# Altium project CC13XXEM-7XD-7793.PrjPcb
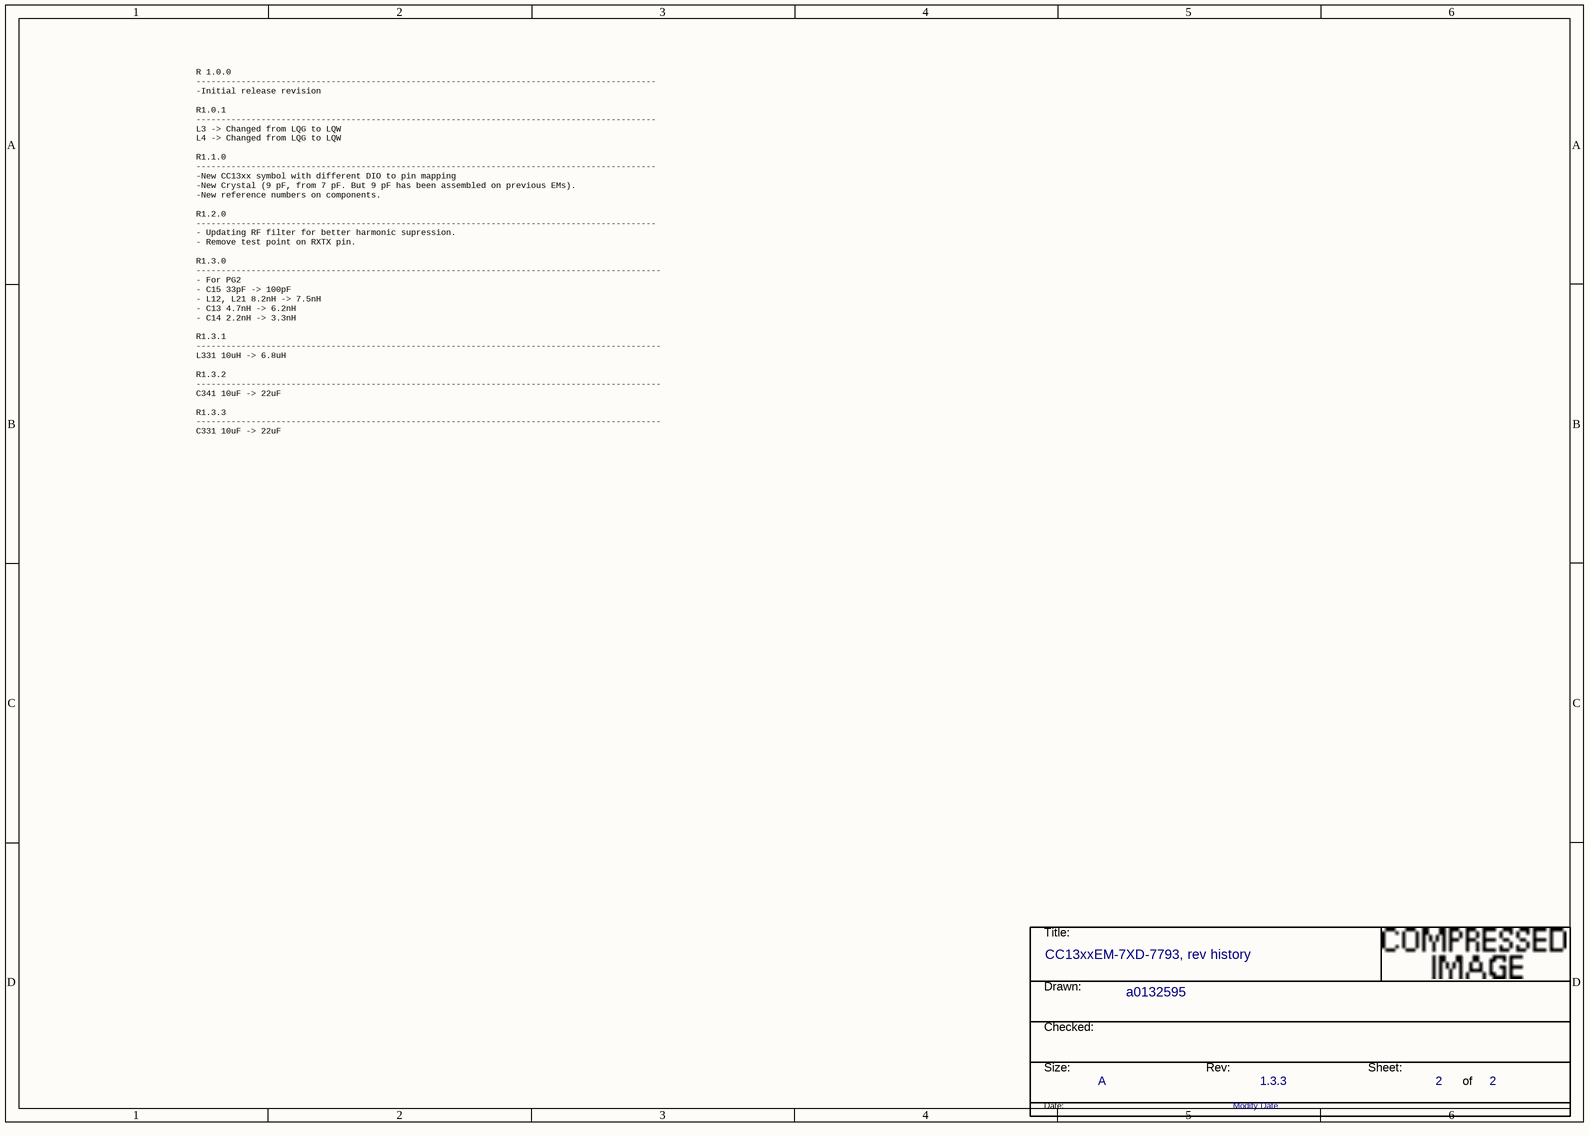
[diagram p0: Revision.SchDoc]
2 sheets, 51 parts. Net scope: global (net labels, ports and power ports of the same name join across sheets).
Sheets:
  Revision.SchDoc
  CC13xxEM-7XD-7793.SchDoc

## Sheet Revision.SchDoc
size 297 x 209 mm

### Parts
(Parts that share a designator on the sheet are numbered #1, #2 ... from top to bottom, then left to right.)
*#1  Title: CC13xxEM-7XD-7793, rev history  Page Number: 2  RevCode: 1.3.3  Page Size: A  Design Modify Date: Modify Date  Designer name: a0132595  (hidden comment: TI_Norway_Title_Block)  (graphical)

### Notes on the sheet
- R 1.0.0
  --------------------------------------------------------------------------------------------
  -Initial release revision
  R1.0.1
  --------------------------------------------------------------------------------------------
  L3 -> Changed from LQG to LQW
  L4 -> Changed from LQG to LQW
  R1.1.0
  --------------------------------------------------------------------------------------------
  -New CC13xx symbol with different DIO to pin mapping
  -New Crystal (9 pF, from 7 pF. But 9 pF has been assembled on previous EMs).
  -New reference numbers on components.
  R1.2.0
  --------------------------------------------------------------------------------------------
  - Updating RF filter for better harmonic supression.
  - Remove test point on RXTX pin.
  R1.3.0
  ---------------------------------------------------------------------------------------------
  - For PG2
  - C15 33pF -> 100pF
  - L12, L21 8.2nH -> 7.5nH
  - C13 4.7nH -> 6.2nH
  - C14 2.2nH -> 3.3nH
  R1.3.1
  ---------------------------------------------------------------------------------------------
  L331 10uH -> 6.8uH
  R1.3.2
  ---------------------------------------------------------------------------------------------
  C341 10uF -> 22uF
  R1.3.3
  ---------------------------------------------------------------------------------------------
  C331 10uF -> 22uF
- (in symbol TI_Norway_Title_Block) Title:; Drawn:; Checked:; Size:; Rev:; Sheet:; of; Date:

### Library data of the parts
*#1 = TI_Norway_Title_Block: Page Count: 2

## Sheet CC13xxEM-7XD-7793.SchDoc
size 420 x 297 mm
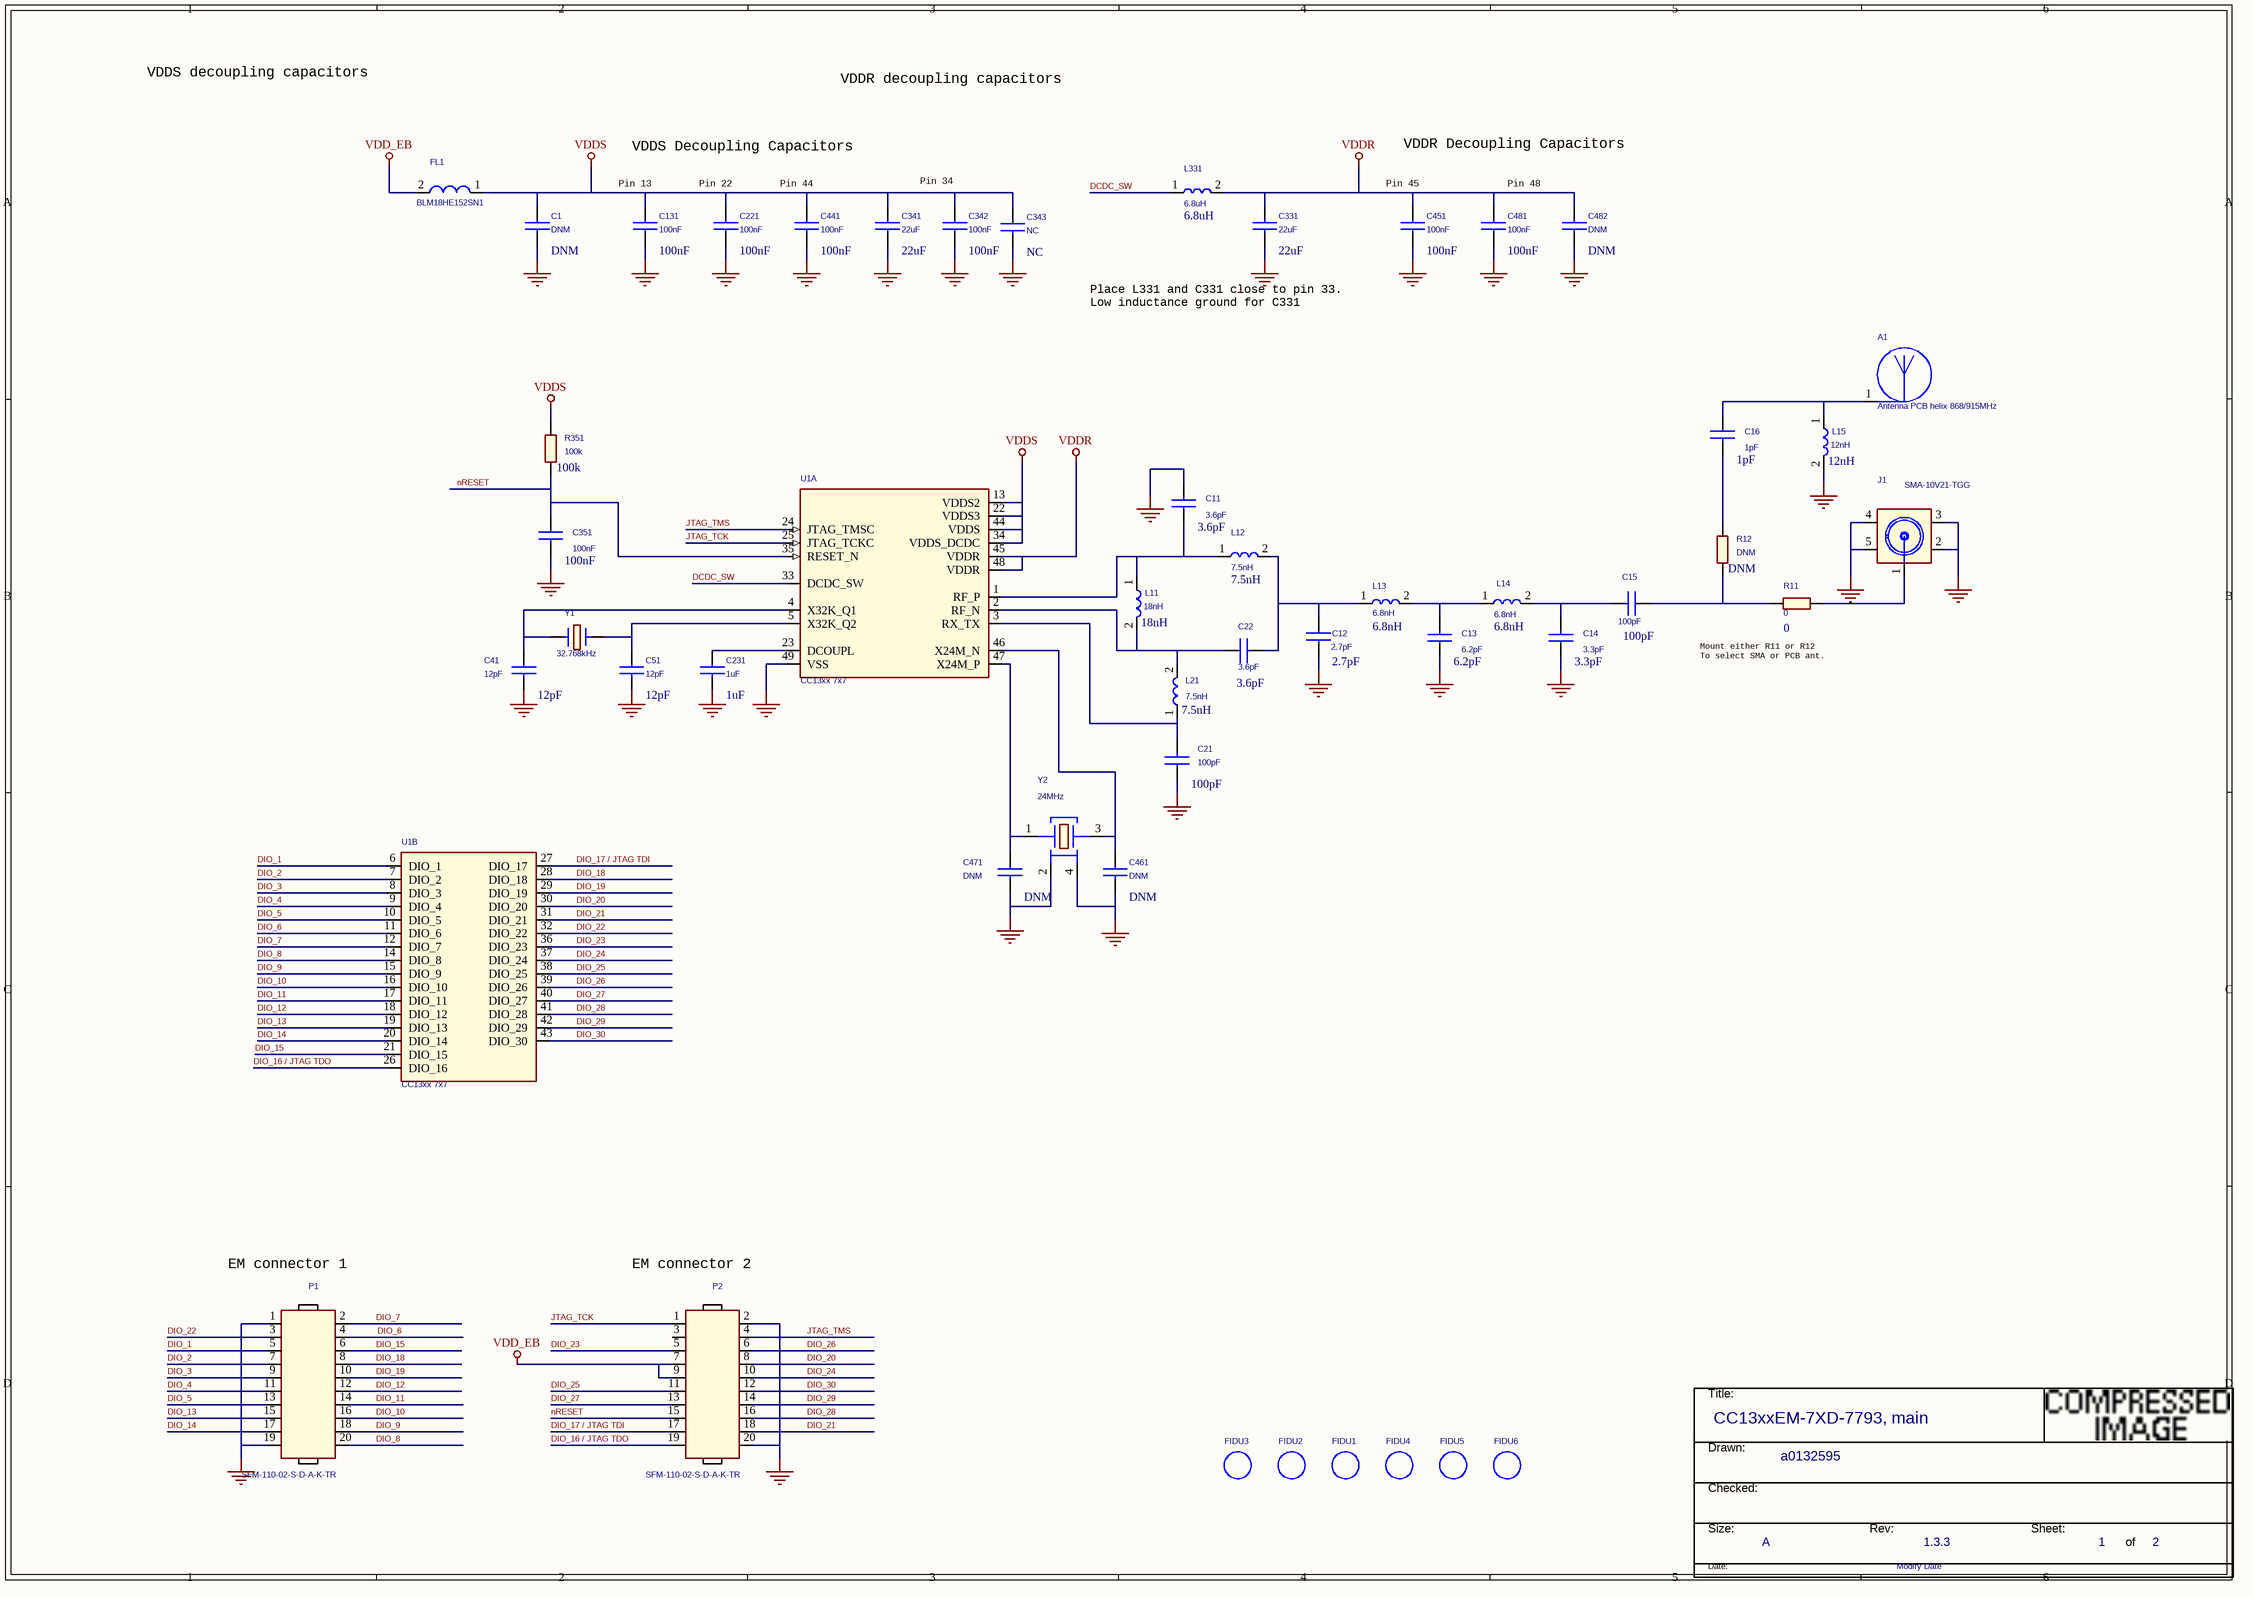
[diagram p1: CC13xxEM-7XD-7793.SchDoc]

### Parts
(Parts that share a designator on the sheet are numbered #1, #2 ... from top to bottom, then left to right.)
*#2  Title: CC13xxEM-7XD-7793, main  Page Number: 1  Page Count: 2  RevCode: 1.3.3  Page Size: A  Design Modify Date: Modify Date  Designer name: a0132595  (hidden comment: TI_Norway_Title_Block)  (graphical)
A1  Antenna PCB helix 868/915MHz  [Antenna868_915MHz]
C1  DNM  [CAPC1608X90L]
C11  3.6pF  [CAPC1005X60L]
C12  2.7pF  [CAPC1005X60L]
C13  6.2pF  [CAPC1005X60L]
C14  3.3pF  [CAPC1005X60L]
C15  100pF  [CAPC1005X60L]
C16  1pF  [CAPC1005X60L]
C21  100pF  [CAPC1005X60L]
C22  3.6pF  [CAPC1005X60L]
C41  12pF  [CAPC1005X60L]
C51  12pF  [CAPC1005X60L]
C131  100nF  [CAPC1005X60L]
C221  100nF  [CAPC1005X60L]
C231  1uF  [CAPC1005X60L]
C331  22uF  [CAPC1608X100A2L]
C341  22uF  [CAPC1608X100A2L]
C342  100nF  [CAPC1608X90L]
C343  NC  [CAPC1608X90L]
C351  100nF  [CAPC1005X60L]
C441  100nF  [CAPC1005X60L]
C451  100nF  [CAPC1005X60L]
C461  DNM  [CAPC1005X60L]
C471  DNM  [CAPC1005X60L]
C481  100nF  [CAPC1005X60L]
C482  DNM  [CAPC1005X60L]
FIDU1  FIDU_1MM  [FIDMARK]  (value not drawn)
FIDU2  FIDU_1MM  [FIDMARK]  (value not drawn)
FIDU3  FIDU_1MM  [FIDMARK]  (value not drawn)
FIDU4  FIDU_1MM  [FIDMARK]  (value not drawn)
FIDU5  FIDU_1MM  [FIDMARK]  (value not drawn)
FIDU6  FIDU_1MM  [FIDMARK]  (value not drawn)
FL1  BLM18HE152SN1  [FIL_BLM18HE152SN1DL]
J1  SMA-10V21-TGG  [HUSTSAN_SMA10V21TGGAN]
L11  18nH  [IND_LQW15AL]
L12  7.5nH  [IND_LQW15AN]
L13  6.8nH  [IND_LQW15AL]
L14  6.8nH  [IND_LQW15AL]
L15  12nH  [IND_LQW15AL]
L21  7.5nH  [IND_LQW15AN]
L331  6.8uH  [INDC2012X150L]
P1  SFM-110-02-S-D-A-K-TR  [SAMTEC_SFM11002AN]
P2  SFM-110-02-S-D-A-K-TR  [SAMTEC_SFM11002AN]
R11  0  [RESC1005X40L]
R12  DNM  [RESC1005X40L]
R351  100k  [RESC1005X40L]
U1  CC13xx 7x7  [QFNFC50P700X700X80-49CN]  (parts A,B of 2)
Y1  32.768kHz  [XTAL_FC-135N]
Y2  24MHz  [OSCCC250X320X60-4L]

### Nets
GND: C1.2 C11.2 C12.2 C13.1 C14.1 C21.1 C41.2 C51.2 C131.2 C221.2 C231.2 C331.2 C341.2 C342.2 C343.2 C351.2 C441.2 C451.2 C461.2 C471.2 C481.2 C482.2 J1.2 J1.3 J1.4 J1.5 L15.2 P1.1 P1.19 P2.2 P2.20 U1.49(VSS) Y2.2 Y2.4
VDD_EB: FL1.2 P2.7 P2.9
VDDR: C331.1 C451.1 C481.1 C482.1 L331.2 U1.45(VDDR) U1.48(VDDR)
VDDS: C1.1 C131.1 C221.1 C341.1 C342.1 C343.1 C441.1 FL1.1 R351.2 U1.13(VDDS2) U1.22(VDDS3) U1.34(VDDS_DCDC) U1.44(VDDS)
DCDC_SW: L331.1 U1.33(DCDC_SW)
DIO_1: P1.5 U1.6(DIO_1)
DIO_2: P1.7 U1.7(DIO_2)
DIO_3: P1.9 U1.8(DIO_3)
DIO_4: P1.11 U1.9(DIO_4)
DIO_5: P1.13 U1.10(DIO_5)
DIO_6: P1.4 U1.11(DIO_6)
DIO_7: P1.2 U1.12(DIO_7)
DIO_8: P1.20 U1.14(DIO_8)
DIO_9: P1.18 U1.15(DIO_9)
DIO_10: P1.16 U1.16(DIO_10)
DIO_11: P1.14 U1.17(DIO_11)
DIO_12: P1.12 U1.18(DIO_12)
DIO_13: P1.15 U1.19(DIO_13)
DIO_14: P1.17 U1.20(DIO_14)
DIO_15: P1.6 U1.21(DIO_15)
DIO_16 / JTAG TDO: P2.19 U1.26(DIO_16)
DIO_17 / JTAG TDI: P2.17 U1.27(DIO_17)
DIO_18: P1.8 U1.28(DIO_18)
DIO_19: P1.10 U1.29(DIO_19)
DIO_20: P2.8 U1.30(DIO_20)
DIO_21: P2.18 U1.31(DIO_21)
DIO_22: P1.3 U1.32(DIO_22)
DIO_23: P2.5 U1.36(DIO_23)
DIO_24: P2.10 U1.37(DIO_24)
DIO_25: P2.11 U1.38(DIO_25)
DIO_26: P2.6 U1.39(DIO_26)
DIO_27: P2.13 U1.40(DIO_27)
DIO_28: P2.16 U1.41(DIO_28)
DIO_29: P2.14 U1.42(DIO_29)
DIO_30: P2.12 U1.43(DIO_30)
JTAG_TCK: P2.1 U1.25(JTAG_TCKC)
JTAG_TMS: P2.4 U1.24(JTAG_TMSC)
nRESET: C351.1 P2.15 R351.1 U1.35(RESET_N)
NetA1_1: A1.1(FEED/GND_1) C16.1 L15.1
NetC11_1: C11.1 L11.1 L12.1 U1.1(RF_P)
NetC12_1: C12.1 C22.2 L12.2 L13.1
NetC13_2: C13.2 L13.2 L14.1
NetC14_2: C14.2 C15.2 L14.2
NetC15_1: C15.1 R11.2 R12.1
NetC16_2: C16.2 R12.2
NetC21_2: C21.2 L21.1 U1.3(RX_TX)
NetC22_1: C22.1 L11.2 L21.2 U1.2(RF_N)
NetC41_1: C41.1 U1.4(X32K_Q1) Y1.1
NetC51_1: C51.1 U1.5(X32K_Q2) Y1.2
NetC231_1: C231.1 U1.23(DCOUPL)
NetC461_1: C461.1 U1.46(X24M_N) Y2.3
NetC471_1: C471.1 U1.47(X24M_P) Y2.1
NetJ1_1: J1.1 R11.1

Not connected (* = marked no-connect by the designer): FIDU1 1; FIDU2 1; FIDU3 1; FIDU4 1; FIDU5 1; FIDU6 1; P2 3

### Notes on the sheet
- VDDS decoupling capacitors
- VDDR decoupling capacitors
- (near C131) Pin 13
- VDDS Decoupling Capacitors
- (near C221) Pin 22
- (near C441) Pin 44
- Pin 34
- (near C451) Pin 45
- VDDR Decoupling Capacitors
- Pin 48
- Place L331 and C331 close to pin 33.
  Low inductance ground for C331
- (near R11) Mount either R11 or R12
  To select SMA or PCB ant.
- (near P1) EM connector 1
- (near P2) EM connector 2
- (in symbol TI_Norway_Title_Block) Title:; Drawn:; Checked:; Size:; Rev:; Sheet:; of; Date:

### Library data of the parts
A1 = ANTENNA: MECHANIC, ANTENNA PCB HELIX 868/915MHz, SMD; Part Number: 13-00397; Manufacturer: TEXAS INSTRUMENTS; MPN Status: ACTIVE; Designed by: Pawel Kwaskiewicz; FPLIST: Antenna868_915MHz,Antenna868_915MHz_MIRROR,; Old Footprint: Antenna868_915MHz,Antenna868_915MHz_MIRROR; NOTE Status: PREFERRED; Definied Quality: COMMERCIAL; Packing Size: 2500; Packing Type: TAPE_&_REEL; Design date: 2010-02-22; Revision: R002; Mounting Type: SMD; Part Type: MECHANIC\ANTENNA; Max Oper Temp: N/A; Min Oper Temp: N/A; Frequency: 868/915MHz; MPN: ANTENNA PCB HELIX 868/915MHz; RoHS Status: ROHS_COMPLIANT; Lead Time: N/A; Budget Price: N/A; Budget Currency: N/A; Last Time Buy: N/A; WEIGHT: N/A; Esd Level: N/A; MTBF: N/A; MTBF Standard: N/A; MSL: N/A; Datasheet URL 1: N/A; Datasheet URL 2: www.ti.com; AutoDoc File: http://notefied-dynamic-precision.com/DB/Apps/Desktop/Item/Object.aspx?id=87165
C1 = CAPACITOR: CAPACITOR, DO NOT MOUNT, 0603, SMD; Part Number: 02-01324; TC2: 0; MAX_TEMP: CTMAX; SLOPE: CSMAX; DIST: FLAT; PSpiceTemplate: C^@REFDES %1 %2 ?TOLERANCE|C^@REFDES| @VALUE ?IC/IC=@IC/ TC=@TC1,@TC2 ?TOLERANCE|\n.model C^@REFDES CAP C=1 DEV=@TOLERANCE%|; KNEE: CBMAX; CURRENT: CIMAX; VOLTAGE: CMAX; Old Footprint: CAPC1608X90N,0603; ALT_SYMBOLS: CAPC1608X90L,CAPC1608X90M; FPLIST: CAPC1608X90N,CAPC1608X90L,CAPC1608X90M; TC1: 0; Value: DNM; AutoDoc File: http://notefied-dynamic-precision.com/DB/Apps/Desktop/Item/Object.aspx?id=50475; Part Type: CAPACITOR\CERAMIC\0603; Revision: R003
C11 = CAPACITOR: CAPACITOR, CERAMIC C0G/NP0, 3.6pF, 50V, -0.25pF/+0.25pF, -55DEGC/+125DEGC, 0402, SMD; MPN Status: ACTIVE; MPN: GRM1555C1H3R6CA01D; Manufacturer: MURATA; Part Number: 02-06008; TC2: 0; MAX_TEMP: CTMAX; SLOPE: CSMAX; DIST: FLAT; PSpiceTemplate: C^@REFDES %1 %2 ?TOLERANCE|C^@REFDES| @VALUE ?IC/IC=@IC/ TC=@TC1,@TC2 ?TOLERANCE|\n.model C^@REFDES CAP C=1 DEV=@TOLERANCE%|; KNEE: CBMAX; CURRENT: CIMAX; VOLTAGE: CMAX; Packing Type: TAPE_&_REEL; Packing Size: 10000; NOTE Status: PREFERRED; PCB Package: 0402; Old Footprint: CAPC1005X60N; ALT_SYMBOLS: CAPC1005X60L,CAPC1005X60M; FPLIST: CAPC1005X60N,CAPC1005X60L,CAPC1005X60M; TC1: 0; Value: 3.6pF; AutoDoc File: http://notefied-dynamic-precision.com/DB/Apps/Desktop/Item/Object.aspx?id=95903; Datasheet URL 2: http://psearch.murata.com/capacitor/product/GRM1555C1H3R6CA01%23.pdf; RoHS Status: ROHS_COMPLIANT; Dielectric Type: C0G/NP0; Capacitance: 3.6pF; Rtd Voltage: 50V; Min Tol: -0.25pF; Max Tol: +0.25pF; Min Oper Temp: -55DEGC; Max Oper Temp: +125DEGC; Part Type: CAPACITOR\CERAMIC\0402; Mounting Type: SMD; Revision: R001
C12 = CAPACITOR: CAPACITOR, CERAMIC C0G/NP0, 2.7pF, 50V, -0.25pF/+0.25pF, -55DEGC/+125DEGC, 0402, SMD; MPN Status: ACTIVE; MPN: GRM1555C1H2R7CA01D; Manufacturer: MURATA; Part Number: 02-04679; TC2: 0; MAX_TEMP: CTMAX; SLOPE: CSMAX; DIST: FLAT; PSpiceTemplate: C^@REFDES %1 %2 ?TOLERANCE|C^@REFDES| @VALUE ?IC/IC=@IC/ TC=@TC1,@TC2 ?TOLERANCE|\n.model C^@REFDES CAP C=1 DEV=@TOLERANCE%|; KNEE: CBMAX; CURRENT: CIMAX; VOLTAGE: CMAX; Packing Type: TAPE_&_REEL; Packing Size: 10000; Budget Currency: EUR; Budget Price: 0.006; NOTE Status: PREFERRED; PCB Package: 0402; Old Footprint: CAPC1005X60N; ALT_SYMBOLS: CAPC1005X60L,CAPC1005X60M; FPLIST: CAPC1005X60N,CAPC1005X60L,CAPC1005X60M; Lead Time: 12; Definied Quality: INDUSTRIAL; TC1: 0; Value: 2.7pF; AutoDoc File: http://notefied-dynamic-precision.com/DB/Apps/Desktop/Item/Object.aspx?id=87809; RoHS Status: ROHS_COMPLIANT; Min Oper Temp: -55DEGC; Max Oper Temp: +125DEGC; Part Type: CAPACITOR\CERAMIC\0402; Mounting Type: SMD; Revision: R001; Max Tol: +0.25pF; Min Tol: -0.25pF; Rtd Voltage: 50V; Capacitance: 2.7pF; Dielectric Type: C0G/NP0; Last Time Buy: N/A; WEIGHT: 0.0016g; Esd Level: N/A; MTBF: N/A; MTBF Standard: N/A; MSL: 1; Datasheet URL 1: http://search.murata.co.jp/Ceramy/image/img/w_hinm/L0005E.pdf; Datasheet URL 2: http://psearch.murata.com/capacitor/product/GRM1555C1H2R7CA01%23.pdf
C13 = CAPACITOR: CAPACITOR, CERAMIC C0G/NP0, 6.2pF, 50V, -0.25pF/+0.25pF, -55DEGC/+125DEGC, 0402, SMD; MPN Status: ACTIVE; MPN: GRM1555C1H6R2CA01D; Manufacturer: MURATA; Part Number: 02-04608; TC2: 0; MAX_TEMP: CTMAX; SLOPE: CSMAX; DIST: FLAT; PSpiceTemplate: C^@REFDES %1 %2 ?TOLERANCE|C^@REFDES| @VALUE ?IC/IC=@IC/ TC=@TC1,@TC2 ?TOLERANCE|\n.model C^@REFDES CAP C=1 DEV=@TOLERANCE%|; KNEE: CBMAX; CURRENT: CIMAX; VOLTAGE: CMAX; Definied Quality: INDUSTRIAL; Budget Currency: EUR; Budget Price: 0.006; Lead Time: 10; Packing Type: TAPE_&_REEL; Packing Size: 10000; NOTE Status: PREFERRED; PCB Package: 0402; Old Footprint: CAPC1005X60N; ALT_SYMBOLS: CAPC1005X60L,CAPC1005X60M; FPLIST: CAPC1005X60N,CAPC1005X60L,CAPC1005X60M; TC1: 0; Value: 6.2pF; MSL: 1; MTBF Standard: N/A; MTBF: N/A; Esd Level: N/A; Last Time Buy: N/A; Datasheet URL 1: http://search.murata.co.jp/Ceramy/image/img/w_hinm/L0005E.pdf; AutoDoc File: http://notefied-dynamic-precision.com/DB/Apps/Desktop/Item/Object.aspx?id=87255; Datasheet URL 2: http://psearch.murata.com/capacitor/product/GRM1555C1H6R2CA01%23.pdf; WEIGHT: 0.0016g; RoHS Status: ROHS_COMPLIANT; Dielectric Type: C0G/NP0; Capacitance: 6.2pF; Rtd Voltage: 50V; Min Tol: -0.25pF; Max Tol: +0.25pF; Min Oper Temp: -55DEGC; Max Oper Temp: +125DEGC; Part Type: CAPACITOR\CERAMIC\0402; Mounting Type: SMD; Revision: R001
C14 = CAPACITOR: CAPACITOR, CERAMIC C0G/NP0, 3.3pF, 50V, -0.25pF/+0.25pF, -55DEGC/+125DEGC, 0402, SMD; Part Number: 02-04369; Manufacturer: MURATA; MPN: GRM1555C1H3R3CA01D; MPN Status: ACTIVE; TC2: 0; MAX_TEMP: CTMAX; SLOPE: CSMAX; DIST: FLAT; PSpiceTemplate: C^@REFDES %1 %2 ?TOLERANCE|C^@REFDES| @VALUE ?IC/IC=@IC/ TC=@TC1,@TC2 ?TOLERANCE|\n.model C^@REFDES CAP C=1 DEV=@TOLERANCE%|; KNEE: CBMAX; CURRENT: CIMAX; VOLTAGE: CMAX; Min TC: -30PPM/DEGC; Max TC: +30PPM/DEGC; FPLIST: CAPC1005X60N,CAPC1005X60L,CAPC1005X60M; ALT_SYMBOLS: CAPC1005X60L,CAPC1005X60M; Old Footprint: CAPC1005X60N; PCB Package: 0402; NOTE Status: PREFERRED; Lead Time: 12; Budget Price: 0.006; Budget Currency: EUR; Packing Size: 10000; Packing Type: TAPE_&_REEL; Definied Quality: INDUSTRIAL; TC1: 0; Value: 3.3pF; Revision: R001; Mounting Type: SMD; Part Type: CAPACITOR\CERAMIC\0402; Max Oper Temp: +125DEGC; Min Oper Temp: -55DEGC; RoHS Status: ROHS_COMPLIANT; WEIGHT: 0.0016g; Datasheet URL 2: http://psearch.murata.com/capacitor/product/GRM1555C1H3R3CA01%23.pdf; AutoDoc File: http://notefied-dynamic-precision.com/DB/Apps/Desktop/Item/Object.aspx?id=86077; Last Time Buy: N/A; Esd Level: N/A; MTBF: N/A; MTBF Standard: N/A; MSL: 1; Datasheet URL 1: http://search.murata.co.jp/Ceramy/image/img/w_hinm/L0005E.pdf; Max Tol: +0.25pF; Min Tol: -0.25pF; Rtd Voltage: 50V; Capacitance: 3.3pF; Dielectric Type: C0G/NP0
C15 C21 = CAPACITOR: CAPACITOR, CERAMIC C0G/NP0, 100pF, 50V, -5%/+5%, -55DEGC/+125DEGC, 0402, SMD; Part Number: 02-04365; Manufacturer: MURATA; MPN: GRM1555C1H101JA01D; MPN Status: ACTIVE; TC2: 0; MAX_TEMP: CTMAX; SLOPE: CSMAX; DIST: FLAT; PSpiceTemplate: C^@REFDES %1 %2 ?TOLERANCE|C^@REFDES| @VALUE ?IC/IC=@IC/ TC=@TC1,@TC2 ?TOLERANCE|\n.model C^@REFDES CAP C=1 DEV=@TOLERANCE%|; KNEE: CBMAX; CURRENT: CIMAX; VOLTAGE: CMAX; Definied Quality: INDUSTRIAL; FPLIST: CAPC1005X60N,CAPC1005X60L,CAPC1005X60M; ALT_SYMBOLS: CAPC1005X60L,CAPC1005X60M; Old Footprint: CAPC1005X60N; PCB Package: 0402; Max Tol: +5%; Min Tol: -5%; Max TC: +30PPM/DEGC; Min TC: -30PPM/DEGC; NOTE Status: PREFERRED; Lead Time: 12; Budget Price: 0.006; Budget Currency: EUR; Packing Size: 10000; Packing Type: TAPE_&_REEL; TC1: 0; Value: 100pF; MSL: 1; MTBF Standard: N/A; MTBF: N/A; Esd Level: N/A; Last Time Buy: N/A; Revision: R002; Mounting Type: SMD; Part Type: CAPACITOR\CERAMIC\0402; Max Oper Temp: +125DEGC; Min Oper Temp: -55DEGC; Rtd Voltage: 50V; Capacitance: 100pF; Dielectric Type: C0G/NP0; RoHS Status: ROHS_COMPLIANT; WEIGHT: 0.0016g; Datasheet URL 1: http://search.murata.co.jp/Ceramy/image/img/w_hinm/L0005E.pdf; Datasheet URL 2: http://psearch.murata.com/capacitor/product/GRM1555C1H101JA01%23.pdf; AutoDoc File: http://notefied-dynamic-precision.com/DB/Apps/Desktop/Item/Object.aspx?id=86072
C16 = CAPACITOR: CAPACITOR, CERAMIC C0G/NP0, 1pF, 50V, -0.25pF/ +0.25pF, -55DEGC/+125DEGC, 0402, SMD; Part Number: 02-04672; Manufacturer: MURATA; MPN: GRM1555C1H1R0CA01D; MPN Status: ACTIVE; TC2: 0; MAX_TEMP: CTMAX; SLOPE: CSMAX; DIST: FLAT; PSpiceTemplate: C^@REFDES %1 %2 ?TOLERANCE|C^@REFDES| @VALUE ?IC/IC=@IC/ TC=@TC1,@TC2 ?TOLERANCE|\n.model C^@REFDES CAP C=1 DEV=@TOLERANCE%|; KNEE: CBMAX; CURRENT: CIMAX; VOLTAGE: CMAX; FPLIST: CAPC1005X60N,CAPC1005X60L,CAPC1005X60M; ALT_SYMBOLS: CAPC1005X60L,CAPC1005X60M; Old Footprint: CAPC1005X60N; PCB Package: 0402; Max TC: +30PPM/DEGC; Min TC: -30PPM/DEGC; NOTE Status: PREFERRED; Lead Time: 12; Budget Price: 0.003; Budget Currency: EUR; Packing Size: 10000; Packing Type: TAPE_&_REEL; TC1: 0; Value: 1pF; Revision: R001; Mounting Type: SMD; Part Type: CAPACITOR\CERAMIC\0402; Max Oper Temp: +125DEGC; Min Oper Temp: -55DEGC; Max Tol: +0.25pF; Min Tol: -0.25pF; Rtd Voltage: 50V; Capacitance: 1pF; Dielectric Type: C0G/NP0; RoHS Status: ROHS_COMPLIANT; WEIGHT: 1.6mg; Datasheet URL 2: http://psearch.murata.com/capacitor/product/GRM1555C1H1R0CA01%23.pdf; AutoDoc File: http://notefied-dynamic-precision.com/DB/Apps/Desktop/Item/Object.aspx?id=87790
C22 = CAPACITOR: CAPACITOR, CERAMIC C0G/NP0, 3.6pF, 50V, -0.25pF/+0.25pF, -55DEGC/+125DEGC, 0402, SMD; MPN Status: ACTIVE; MPN: GRM1555C1H3R6CA01D; Manufacturer: MURATA; Part Number: 02-06008; TC2: 0; MAX_TEMP: CTMAX; SLOPE: CSMAX; DIST: FLAT; PSpiceTemplate: C^@REFDES %1 %2 ?TOLERANCE|C^@REFDES| @VALUE ?IC/IC=@IC/ TC=@TC1,@TC2 ?TOLERANCE|\n.model C^@REFDES CAP C=1 DEV=@TOLERANCE%|; KNEE: CBMAX; CURRENT: CIMAX; VOLTAGE: CMAX; FPLIST: CAPC1005X60N,CAPC1005X60L,CAPC1005X60M; Packing Type: TAPE_&_REEL; Packing Size: 10000; NOTE Status: PREFERRED; PCB Package: 0402; Old Footprint: CAPC1005X60N; ALT_SYMBOLS: CAPC1005X60L,CAPC1005X60M; TC1: 0; Value: 3.6pF; AutoDoc File: http://notefied-dynamic-precision.com/DB/Apps/Desktop/Item/Object.aspx?id=95903; Datasheet URL 2: http://psearch.murata.com/capacitor/product/GRM1555C1H3R6CA01%23.pdf; RoHS Status: ROHS_COMPLIANT; Dielectric Type: C0G/NP0; Capacitance: 3.6pF; Rtd Voltage: 50V; Min Tol: -0.25pF; Max Tol: +0.25pF; Min Oper Temp: -55DEGC; Max Oper Temp: +125DEGC; Part Type: CAPACITOR\CERAMIC\0402; Mounting Type: SMD; Revision: R001
C41 = CAPACITOR: CAPACITOR, CERAMIC C0G/NP0, 12pF, 50V, -5%/+5%, -55DEGC/+125DEGC, 0402, SMD; Part Number: 02-04168; Manufacturer: MURATA; MPN: GRM1555C1H120JA01D; MPN Status: ACTIVE; TC2: 0; MAX_TEMP: CTMAX; SLOPE: CSMAX; DIST: FLAT; PSpiceTemplate: C^@REFDES %1 %2 ?TOLERANCE|C^@REFDES| @VALUE ?IC/IC=@IC/ TC=@TC1,@TC2 ?TOLERANCE|\n.model C^@REFDES CAP C=1 DEV=@TOLERANCE%|; KNEE: CBMAX; CURRENT: CIMAX; VOLTAGE: CMAX; FPLIST: CAPC1005X60N,CAPC1005X60L,CAPC1005X60M; ALT_SYMBOLS: CAPC1005X60L,CAPC1005X60M; Old Footprint: CAPC1005X60N; PCB Package: 0402; Max Tol: +5%; Min Tol: -5%; NOTE Status: PREFERRED; Lead Time: 12; Budget Price: 0.006; Budget Currency: EUR; Definied Quality: INDUSTRIAL; Packing Size: 10000; Packing Type: TAPE_&_REEL; Max TC: +30PPM/DEGC; Min TC: -30PPM/DEGC; TC1: 0; Value: 12pF; Revision: R000; Mounting Type: SMD; Part Type: CAPACITOR\CERAMIC\0402; Max Oper Temp: +125DEGC; Min Oper Temp: -55DEGC; Rtd Voltage: 50V; Capacitance: 12pF; Dielectric Type: C0G/NP0; RoHS Status: ROHS_COMPLIANT; Last Time Buy: N/A; WEIGHT: 0.0016g; Esd Level: N/A; MTBF: N/A; MTBF Standard: N/A; MSL: 1; Datasheet URL 1: http://search.murata.co.jp/Ceramy/image/img/w_hinm/L0005E.pdf; Datasheet URL 2: http://psearch.murata.com/capacitor/product/GRM1555C1H120JA01%23.pdf; AutoDoc File: http://notefied-dynamic-precision.com/DB/Apps/Desktop/Item/Object.aspx?id=84867
C51 = CAPACITOR: CAPACITOR, CERAMIC C0G/NP0, 12pF, 50V, -5%/+5%, -55DEGC/+125DEGC, 0402, SMD; MPN Status: ACTIVE; MPN: GRM1555C1H120JA01D; Manufacturer: MURATA; Part Number: 02-04168; TC2: 0; MAX_TEMP: CTMAX; SLOPE: CSMAX; DIST: FLAT; PSpiceTemplate: C^@REFDES %1 %2 ?TOLERANCE|C^@REFDES| @VALUE ?IC/IC=@IC/ TC=@TC1,@TC2 ?TOLERANCE|\n.model C^@REFDES CAP C=1 DEV=@TOLERANCE%|; KNEE: CBMAX; CURRENT: CIMAX; VOLTAGE: CMAX; Packing Type: TAPE_&_REEL; Packing Size: 10000; Definied Quality: INDUSTRIAL; Budget Currency: EUR; Budget Price: 0.006; Lead Time: 12; NOTE Status: PREFERRED; Min Tol: -5%; Max Tol: +5%; PCB Package: 0402; Old Footprint: CAPC1005X60N; ALT_SYMBOLS: CAPC1005X60L,CAPC1005X60M; FPLIST: CAPC1005X60N,CAPC1005X60L,CAPC1005X60M; Max TC: +30PPM/DEGC; Min TC: -30PPM/DEGC; TC1: 0; Value: 12pF; AutoDoc File: http://notefied-dynamic-precision.com/DB/Apps/Desktop/Item/Object.aspx?id=84867; Datasheet URL 2: http://psearch.murata.com/capacitor/product/GRM1555C1H120JA01%23.pdf; Datasheet URL 1: http://search.murata.co.jp/Ceramy/image/img/w_hinm/L0005E.pdf; MSL: 1; MTBF Standard: N/A; MTBF: N/A; Esd Level: N/A; WEIGHT: 0.0016g; Last Time Buy: N/A; RoHS Status: ROHS_COMPLIANT; Dielectric Type: C0G/NP0; Capacitance: 12pF; Rtd Voltage: 50V; Min Oper Temp: -55DEGC; Max Oper Temp: +125DEGC; Part Type: CAPACITOR\CERAMIC\0402; Mounting Type: SMD; Revision: R000
C131 = CAPACITOR: CAPACITOR, CERAMIC X7R, 100nF, 6.3V, -10%/+10%, -55DEGC/+125DEGC, 0402, SMD; Part Number: 02-02323; Manufacturer: MURATA; MPN: GRM155R70J104KA01D; MPN Status: ACTIVE; TC2: 0; MAX_TEMP: CTMAX; SLOPE: CSMAX; DIST: FLAT; PSpiceTemplate: C^@REFDES %1 %2 ?TOLERANCE|C^@REFDES| @VALUE ?IC/IC=@IC/ TC=@TC1,@TC2 ?TOLERANCE|\n.model C^@REFDES CAP C=1 DEV=@TOLERANCE%|; KNEE: CBMAX; CURRENT: CIMAX; VOLTAGE: CMAX; FPLIST: CAPC1005X60N,CAPC1005X60L,CAPC1005X60M; ALT_SYMBOLS: CAPC1005X60L,CAPC1005X60M; Old Footprint: CAPC1005X60N,0402; PCB Package: 0402; Max Tol: +10%; Min Tol: -10%; NOTE Status: PREFERRED; Lead Time: 10; Budget Price: 0.003; Budget Currency: EUR; Packing Size: 10000; Packing Type: TAPE_&_REEL; TC1: 0; Value: 100nF; Revision: R000; Mounting Type: SMD; Part Type: CAPACITOR\CERAMIC\0402; Max Oper Temp: +125DEGC; Min Oper Temp: -55DEGC; Rtd Voltage: 6.3V; Capacitance: 100nF; Dielectric Type: X7R; RoHS Status: ROHS_COMPLIANT; LifeCycle Status: ACTIVE; WEIGHT: 0.0016g; Datasheet URL 1: http://search.murata.co.jp/Ceramy/image/img/A01X/G101/ENG/GRM155R70J104KA01-01.pdf; Datasheet URL 2: http://search.murata.co.jp/Ceramy/image/img/A01X/G101/ENG/GRM155R70J104KA01-01.pdf; AutoDoc File: http://notefied-dynamic-precision.com/DB/Apps/Desktop/Item/Object.aspx?id=73748
C221 C481 = CAPACITOR: CAPACITOR, CERAMIC X7R, 100nF, 6.3V, -10%/+10%, -55DEGC/+125DEGC, 0402, SMD; MPN Status: ACTIVE; MPN: GRM155R70J104KA01D; Manufacturer: MURATA; Part Number: 02-02323; TC2: 0; MAX_TEMP: CTMAX; SLOPE: CSMAX; DIST: FLAT; PSpiceTemplate: C^@REFDES %1 %2 ?TOLERANCE|C^@REFDES| @VALUE ?IC/IC=@IC/ TC=@TC1,@TC2 ?TOLERANCE|\n.model C^@REFDES CAP C=1 DEV=@TOLERANCE%|; KNEE: CBMAX; CURRENT: CIMAX; VOLTAGE: CMAX; FPLIST: CAPC1005X60N,CAPC1005X60L,CAPC1005X60M; Packing Type: TAPE_&_REEL; Packing Size: 10000; Budget Currency: EUR; Budget Price: 0.003; Lead Time: 10; NOTE Status: PREFERRED; Min Tol: -10%; Max Tol: +10%; PCB Package: 0402; Old Footprint: CAPC1005X60N,0402; ALT_SYMBOLS: CAPC1005X60L,CAPC1005X60M; TC1: 0; Value: 100nF; AutoDoc File: http://notefied-dynamic-precision.com/DB/Apps/Desktop/Item/Object.aspx?id=73748; Datasheet URL 2: http://search.murata.co.jp/Ceramy/image/img/A01X/G101/ENG/GRM155R70J104KA01-01.pdf; Datasheet URL 1: http://search.murata.co.jp/Ceramy/image/img/A01X/G101/ENG/GRM155R70J104KA01-01.pdf; WEIGHT: 0.0016g; LifeCycle Status: ACTIVE; RoHS Status: ROHS_COMPLIANT; Dielectric Type: X7R; Capacitance: 100nF; Rtd Voltage: 6.3V; Min Oper Temp: -55DEGC; Max Oper Temp: +125DEGC; Part Type: CAPACITOR\CERAMIC\0402; Mounting Type: SMD; Revision: R000
C231 = CAPACITOR: CAPACITOR, CERAMIC X5R, 1uF, 10V, -10%/+10%, -55DEGC/+85DEGC, 0402, SMD; MPN Status: ACTIVE; MPN: GRM155R61A105KE15D; Manufacturer: MURATA; Part Number: 02-02381; TC2: 0; MAX_TEMP: CTMAX; SLOPE: CSMAX; DIST: FLAT; PSpiceTemplate: C^@REFDES %1 %2 ?TOLERANCE|C^@REFDES| @VALUE ?IC/IC=@IC/ TC=@TC1,@TC2 ?TOLERANCE|\n.model C^@REFDES CAP C=1 DEV=@TOLERANCE%|; KNEE: CBMAX; CURRENT: CIMAX; VOLTAGE: CMAX; Packing Type: TAPE_&_REEL; Packing Size: 10000; Definied Quality: INDUSTRIAL; Budget Currency: EUR; Budget Price: 0.015; Lead Time: 14; NOTE Status: PREFERRED; Min Tol: -10%; Max Tol: +10%; PCB Package: 0402; Old Footprint: CAPC1005X60N,0402; ALT_SYMBOLS: CAPC1005X60L,CAPC1005X60M; FPLIST: CAPC1005X60N,CAPC1005X60L,CAPC1005X60M; TC1: 0; Value: 1uF; AutoDoc File: http://notefied-dynamic-precision.com/DB/Apps/Desktop/Item/Object.aspx?id=74236; Datasheet URL 2: http://psearch.murata.com/capacitor/product/GRM155R61A105KE15%23.pdf; Datasheet URL 1: http://search.murata.co.jp/Ceramy/image/img/w_hinm/L0005E.pdf; MSL: 1; MTBF Standard: N/A; MTBF: N/A; Esd Level: N/A; WEIGHT: 0.0016g; Last Time Buy: N/A; RoHS Status: ROHS_COMPLIANT; Dielectric Type: X5R; Capacitance: 1uF; Rtd Voltage: 10V; Min Oper Temp: -55DEGC; Max Oper Temp: +85DEGC; Part Type: CAPACITOR\CERAMIC\0402; Mounting Type: SMD; Revision: R002
C331 C341 = CAPACITOR: CAPACITOR, CERAMIC, X5R, 22uF, 6.3V, -20%/+20%, -55DEGC/+85DEGC, 0603, SMD; Part Number: 02-07053; Manufacturer: MURATA; MPN: GRM188R60J226MEA0D; MPN Status: ACTIVE; TC2: 0; MAX_TEMP: CTMAX; SLOPE: CSMAX; DIST: FLAT; PSpiceTemplate: C^@REFDES %1 %2 ?TOLERANCE|C^@REFDES| @VALUE ?IC/IC=@IC/ TC=@TC1,@TC2 ?TOLERANCE|\n.model C^@REFDES CAP C=1 DEV=@TOLERANCE%|; KNEE: CBMAX; CURRENT: CIMAX; VOLTAGE: CMAX; FPLIST: CAPC1608X100A2N,CAPC1608X100A2L,CAPC1608X100A2M; ALT_SYMBOLS: CAPC1608X100A2L,CAPC1608X100A2M; Old Footprint: CAPC1608X100A2N; PCB Package: 0603; Max Tol: +20%; Min Tol: -20%; NOTE Status: PREFERRED; Lead Time: 26; Budget Price: 0.045; Budget Currency: USD; Definied Quality: INDUSTRIAL; Packing Size: 4000; Packing Type: TAPE_&_REEL; TC1: 0; Value: 22uF; LifeCycle Status: ACTIVE; Revision: R001; Mounting Type: SMD; Part Type: CAPACITOR\CERAMIC\0603; Max Oper Temp: +85DEGC; Min Oper Temp: -55DEGC; Rtd Voltage: 6.3V; Capacitance: 22uF; Dielectric Type: X5R; RoHS Status: ROHS_COMPLIANT; Last Time Buy: N/A; WEIGHT: 0.0091g; Esd Level: N/A; Datasheet URL 1: N/A; Datasheet URL 2: http://psearch.en.murata.com/capacitor/product/GRM188R60J226MEA0%23.pdf; AutoDoc File: http://notefied-dynamic-precision.com/DB/Apps/Desktop/Item/Object.aspx?id=104385
C342 = CAPACITOR: CAPACITOR, CERAMIC X7R, 100nF, 25V, -10%/+10%, -55DEGC/+125DEGC, 0603, SMD; Part Number: 02-01992; Manufacturer: MURATA; MPN: GRM188R71E104KA01D; MPN Status: NRND; TC2: 0; MAX_TEMP: CTMAX; SLOPE: CSMAX; DIST: FLAT; PSpiceTemplate: C^@REFDES %1 %2 ?TOLERANCE|C^@REFDES| @VALUE ?IC/IC=@IC/ TC=@TC1,@TC2 ?TOLERANCE|\n.model C^@REFDES CAP C=1 DEV=@TOLERANCE%|; KNEE: CBMAX; CURRENT: CIMAX; VOLTAGE: CMAX; Cage Code: C0151; Min Tol: -10%; Max Tol: +10%; Definied Quality: INDUSTRIAL; Lead Time: 10; FPLIST: CAPC1608X90N,CAPC1608X90L,CAPC1608X90M; ALT_SYMBOLS: CAPC1608X90L,CAPC1608X90M; Old Footprint: CAPC1608X90N,0603; PCB Package: 0603; NOTE Status: PREFERRED; Budget Price: 0.006; Budget Currency: EUR; Packing Size: 4000; Packing Type: TAPE_&_REEL; TC1: 0; Value: 100nF; Dielectric Type: X7R; Capacitance: 100nF; Rtd Voltage: 25V; MSL: 1; MTBF Standard: N/A; MTBF: N/A; Esd Level: N/A; Last Time Buy: N/A; Revision: R001; Mounting Type: SMD; Part Type: CAPACITOR\CERAMIC\0603; Max Oper Temp: +125DEGC; Min Oper Temp: -55DEGC; RoHS Status: ROHS_COMPLIANT; WEIGHT: 0.0063g; Datasheet URL 1: http://search.murata.co.jp/Ceramy/image/img/w_hinm/L0005E.pdf; Datasheet URL 2: http://psearch.murata.com/capacitor/product/GRM188R71E104KA01%23.pdf; AutoDoc File: http://notefied-dynamic-precision.com/DB/Apps/Desktop/Item/Object.aspx?id=72070
C343 = CAPACITOR: CAPACITOR, CERAMIC, N/A VALUE, -55DEGC/+125DEGC, 0603, SMD; MPN Status: ACTIVE; MPN: CAPACITOR_0603_N/A_M; Manufacturer: MANUFACTURER SELECTION; Part Number: 02-01235; TC2: 0; MAX_TEMP: CTMAX; SLOPE: CSMAX; DIST: FLAT; PSpiceTemplate: C^@REFDES %1 %2 ?TOLERANCE|C^@REFDES| @VALUE ?IC/IC=@IC/ TC=@TC1,@TC2 ?TOLERANCE|\n.model C^@REFDES CAP C=1 DEV=@TOLERANCE%|; KNEE: CBMAX; CURRENT: CIMAX; VOLTAGE: CMAX; Packing Type: TAPE_&_REEL; Packing Size: 5000; Budget Currency: USD; Budget Price: 0.00262; NOTE Status: PREFERRED; PCB Package: 0603; Old Footprint: CAPC1608X90N,0603; ALT_SYMBOLS: CAPC1608X90L,CAPC1608X90M; FPLIST: CAPC1608X90N,CAPC1608X90L,CAPC1608X90M; Definied Quality: INDUSTRIAL; TC1: 0; Value: NC; AutoDoc File: http://notefied-dynamic-precision.com/DB/Apps/Desktop/Item/Object.aspx?id=50386; Datasheet URL 2: N/A; Datasheet URL 1: N/A; WEIGHT: 0.002g; RoHS Status: ROHS_COMPLIANT; Min Oper Temp: -55DEGC; Max Oper Temp: +125DEGC; Part Type: CAPACITOR\CERAMIC\0603; Mounting Type: SMD; Revision: R001; Lead Time: N/A; Last Time Buy: N/A; Esd Level: N/A; MTBF: N/A; MTBF Standard: N/A; MSL: N/A
C351 C441 C451 = CAPACITOR: CAPACITOR, CERAMIC X7R, 100nF, 6.3V, -10%/+10%, -55DEGC/+125DEGC, 0402, SMD; MPN Status: ACTIVE; MPN: GRM155R70J104KA01D; Manufacturer: MURATA; Part Number: 02-02323; TC2: 0; MAX_TEMP: CTMAX; SLOPE: CSMAX; DIST: FLAT; PSpiceTemplate: C^@REFDES %1 %2 ?TOLERANCE|C^@REFDES| @VALUE ?IC/IC=@IC/ TC=@TC1,@TC2 ?TOLERANCE|\n.model C^@REFDES CAP C=1 DEV=@TOLERANCE%|; KNEE: CBMAX; CURRENT: CIMAX; VOLTAGE: CMAX; Packing Type: TAPE_&_REEL; Packing Size: 10000; Budget Currency: EUR; Budget Price: 0.003; Lead Time: 10; NOTE Status: PREFERRED; Min Tol: -10%; Max Tol: +10%; PCB Package: 0402; Old Footprint: CAPC1005X60N,0402; ALT_SYMBOLS: CAPC1005X60L,CAPC1005X60M; FPLIST: CAPC1005X60N,CAPC1005X60L,CAPC1005X60M; TC1: 0; Value: 100nF; AutoDoc File: http://notefied-dynamic-precision.com/DB/Apps/Desktop/Item/Object.aspx?id=73748; Datasheet URL 2: http://search.murata.co.jp/Ceramy/image/img/A01X/G101/ENG/GRM155R70J104KA01-01.pdf; Datasheet URL 1: http://search.murata.co.jp/Ceramy/image/img/A01X/G101/ENG/GRM155R70J104KA01-01.pdf; WEIGHT: 0.0016g; LifeCycle Status: ACTIVE; RoHS Status: ROHS_COMPLIANT; Dielectric Type: X7R; Capacitance: 100nF; Rtd Voltage: 6.3V; Min Oper Temp: -55DEGC; Max Oper Temp: +125DEGC; Part Type: CAPACITOR\CERAMIC\0402; Mounting Type: SMD; Revision: R000
C461 C482 = CAPACITOR: CAPACITOR, CERAMIC, N/A VALUE, -55DEGC/+125DEGC, 0402, SMD; Part Number: 02-04164; Manufacturer: Manufacturer selection; MPN: CAPACITOR_0402_DNM_N/A_M; MPN Status: ACTIVE; TC2: 0; MAX_TEMP: CTMAX; SLOPE: CSMAX; DIST: FLAT; PSpiceTemplate: C^@REFDES %1 %2 ?TOLERANCE|C^@REFDES| @VALUE ?IC/IC=@IC/ TC=@TC1,@TC2 ?TOLERANCE|\n.model C^@REFDES CAP C=1 DEV=@TOLERANCE%|; KNEE: CBMAX; CURRENT: CIMAX; VOLTAGE: CMAX; FPLIST: CAPC1005X60N,CAPC1005X60L,CAPC1005X60M; ALT_SYMBOLS: CAPC1005X60L,CAPC1005X60M; Old Footprint: CAPC1005X60N; PCB Package: 0402; NOTE Status: PREFERRED; Budget Price: 0.00589; Budget Currency: USD; Packing Size: 10000; Packing Type: TAPE_&_REEL; TC1: 0; Value: DNM; Revision: R000; Mounting Type: SMD; Part Type: CAPACITOR\CERAMIC\0402; Max Oper Temp: +125DEGC; Min Oper Temp: -55DEGC; RoHS Status: PART NOT KNOWN; AutoDoc File: http://notefied-dynamic-precision.com/DB/Apps/Desktop/Item/Object.aspx?id=84862
C471 = CAPACITOR: CAPACITOR, CERAMIC, N/A VALUE, -55DEGC/+125DEGC, 0402, SMD; MPN Status: ACTIVE; MPN: CAPACITOR_0402_DNM_N/A_M; Manufacturer: Manufacturer selection; Part Number: 02-04164; TC2: 0; MAX_TEMP: CTMAX; SLOPE: CSMAX; DIST: FLAT; PSpiceTemplate: C^@REFDES %1 %2 ?TOLERANCE|C^@REFDES| @VALUE ?IC/IC=@IC/ TC=@TC1,@TC2 ?TOLERANCE|\n.model C^@REFDES CAP C=1 DEV=@TOLERANCE%|; KNEE: CBMAX; CURRENT: CIMAX; VOLTAGE: CMAX; Packing Type: TAPE_&_REEL; Packing Size: 10000; Budget Currency: USD; Budget Price: 0.00589; NOTE Status: PREFERRED; PCB Package: 0402; Old Footprint: CAPC1005X60N; ALT_SYMBOLS: CAPC1005X60L,CAPC1005X60M; FPLIST: CAPC1005X60N,CAPC1005X60L,CAPC1005X60M; TC1: 0; Value: DNM; AutoDoc File: http://notefied-dynamic-precision.com/DB/Apps/Desktop/Item/Object.aspx?id=84862; RoHS Status: PART NOT KNOWN; Min Oper Temp: -55DEGC; Max Oper Temp: +125DEGC; Part Type: CAPACITOR\CERAMIC\0402; Mounting Type: SMD; Revision: R000
FIDU1-FIDU6 = FIDMARK: FIDUCIAL MARK, ROUND 1MM; Part Number: 19-00111; Old Footprint: FID100X115; AutoDoc File: http://notefied-dynamic-precision.com/DB/Apps/Desktop/Item/Object.aspx?id=74548; Part Type: NON_COMPONENT\FIDUCIAL; Revision: R001
FL1 = FILTER_2PIN: FILTER, EMI, 1500@100MHz, -55DEGC/+125DEGC, 0603, SMD; MPN Status: ACTIVE; MPN: BLM18HE152SN1D; Manufacturer: MURATA; Part Number: 04-00470; Packing Type: TAPE_&_REEL; Packing Size: 4000; Budget Currency: EUR; Budget Price: 0.085; Lead Time: 26; NOTE Status: PREFERRED; Rtd Current: 0.5A; Min Tol: -25%; Max Tol: +25%; PCB Package: 0603; Old Footprint: FIL_BLM18HE152SN1DN; ALT_SYMBOLS: FIL_BLM18HE152SN1DL,FIL_BLM18HE152SN1DM; FPLIST: FIL_BLM18HE152SN1DN,FIL_BLM18HE152SN1DL,FIL_BLM18HE152SN1DM; AutoDoc File: http://notefied-dynamic-precision.com/DB/Apps/Desktop/Item/Object.aspx?id=85575; Datasheet URL 2: http://search.murata.co.jp/Ceramy/image/img/PDF/ENG/L0110S0101BLM18H.pdf; Datasheet URL 1: http://search.murata.co.jp/Ceramy/image/img/PDF/ENG/L0110S0101BLM18H.pdf; WEIGHT: 0.006g; RoHS Status: ROHS_COMPLIANT; Impedance: 1500@100MHz; Min Oper Temp: -55DEGC; Max Oper Temp: +125DEGC; Part Type: FILTER\EMI\0603; Mounting Type: SMD; Revision: R001
J1 = CONN_COAX_1+4: CONNECTOR, COAX RF, STRAIGHT, FEMALE, 1 PIN, SMD; Part Number: 06-02188; Manufacturer: HUS-TSAN; MPN Status: ACTIVE; FPLIST: HUSTSAN_SMA10V21TGGAN,HUSTSAN_SMA10V21TGGN; ALT_SYMBOLS: HUSTSAN_SMA10V21TGGL,HUSTSAN_SMA10V21TGGM; No Of Pos: 1; NOTE Status: PREFERRED; Lead Time: 5; Budget Price: 1.21; Budget Currency: USD; Packing Size: 350; Packing Type: TAPE_&_REEL; Revision: R003; Old Footprint: HUSTSAN_SMA10V21TGGAN,HUSTSAN_SMA10V21TGGN; Mounting Type: SMD; Part Type: CONNECTOR\COAX; MPN: SMA-10V21-TGG; RoHS Status: N/A; WEIGHT: N/A; MSL: N/A; Datasheet URL 1: http://www.hustsan.com.tw/uploaddir/product/SMA-10V21.pdf; Datasheet URL 2: http://www.hustsan.com.tw/uploaddir/product/SMA-10V21.pdf; AutoDoc File: http://notefied-dynamic-precision.com/DB/Apps/Desktop/Item/Object.aspx?id=84956
L11 = INDUCTOR: INDUCTOR, CHIP, 18nH, -5%/+5%, 0.37A, -55DEGC/+125DEGC, 0402, SMD; Part Number: 03-06593; Manufacturer: MURATA; MPN: LQW15AN18NJ00D; MPN Status: NRND; DIST: FLAT; DIELECTRIC: DSMAX; PSpiceTemplate: L^@REFDES %1 %2 ?TOLERANCE|L^@REFDES| @VALUE ?IC/IC=@IC/ ?TOLERANCE|\n.model l^@REFDES IND L=1 DEV=@TOLERANCE%|; Current: LMAX; FPLIST: IND_LQW15AN,INDC1005X60N,IND_LQW15AL,IND_LQW15AM,INDC1005X60L,INDC1005X60M; ALT_SYMBOLS: IND_LQW15AL,IND_LQW15AM,INDC1005X60L,INDC1005X60M; Old Footprint: IND_LQW15AN,INDC1005X60N; PCB Package: 0402; Max Tol: +5%; Min Tol: -5%; Resistance: 0.27; Frequency: 4.5GHz; NOTE Status: PREFERRED; Lead Time: 9; Budget Price: 0.117; Budget Currency: EUR; Definied Quality: INDUSTRIAL; Packing Size: 10000; Packing Type: TAPE_&_REEL; Value: 18nH; Revision: R002; Mounting Type: SMD; Part Type: INDUCTOR\CHIP\0402; Max Oper Temp: +125DEGC; Min Oper Temp: -55DEGC; Rtd Current: 0.37A; Inductance: 18nH; RoHS Status: ROHS_COMPLIANT; Last Time Buy: N/A; WEIGHT: 0.0008g; Esd Level: N/A; MTBF: N/A; MTBF Standard: N/A; MSL: N/A; Datasheet URL 1: N/A; Datasheet URL 2: http://psearch.murata.com/inductor/product/LQW15AN18NJ00%23.pdf; AutoDoc File: http://notefied-dynamic-precision.com/DB/Apps/Desktop/Item/Object.aspx?id=87275
L12 = INDUCTOR: INDUCTOR, CHIP, 7.5nH, -2%/+2%, 0.57A, -55DEGC/+125DEGC, 0402, SMD; MPN Status: NRND; MPN: LQW15AN7N5G00D; Manufacturer: MURATA; Part Number: 03-06551; DIST: FLAT; DIELECTRIC: DSMAX; PSpiceTemplate: L^@REFDES %1 %2 ?TOLERANCE|L^@REFDES| @VALUE ?IC/IC=@IC/ ?TOLERANCE|\n.model l^@REFDES IND L=1 DEV=@TOLERANCE%|; Current: LMAX; Definied Quality: INDUSTRIAL; Packing Type: TAPE_&_REEL; Packing Size: 10000; Budget Currency: EUR; Budget Price: 0.128; Lead Time: 9; NOTE Status: PREFERRED; Frequency: 6GHz; Resistance: 0.13; Min Tol: -2%; Max Tol: +2%; PCB Package: 0402; ALT_SYMBOLS: IND_LQW15AM,IND_LQW15AL; FPLIST: IND_LQW15AN,IND_LQW15AM,IND_LQW15AL; Value: 7.5nH; MSL: N/A; MTBF Standard: N/A; MTBF: N/A; Esd Level: N/A; Last Time Buy: N/A; AutoDoc File: http://notefied-dynamic-precision.com/DB/Apps/Desktop/Item/Object.aspx?id=86081; Datasheet URL 2: http://psearch.murata.com/inductor/product/LQW15AN7N5G00%23.pdf; Datasheet URL 1: N/A; WEIGHT: 0.0008g; RoHS Status: ROHS_COMPLIANT; Inductance: 7.5nH; Rtd Current: 0.57A; Min Oper Temp: -55DEGC; Max Oper Temp: +125DEGC; Part Type: INDUCTOR\CHIP\0402; Mounting Type: SMD; Old Footprint: IND_LQW15AN; Revision: R001
L13 = INDUCTOR: INDUCTOR, CHIP, 6.8nH, -2%/+2%, 0.7A, -55DEGC/+125DEGC, 0402, SMD; MPN Status: ACTIVE; MPN: LQW15AN6N8G00D; Manufacturer: MURATA; Part Number: 03-06553; DIST: FLAT; DIELECTRIC: DSMAX; PSpiceTemplate: L^@REFDES %1 %2 ?TOLERANCE|L^@REFDES| @VALUE ?IC/IC=@IC/ ?TOLERANCE|\n.model l^@REFDES IND L=1 DEV=@TOLERANCE%|; Current: LMAX; Definied Quality: INDUSTRIAL; Resistance: 0.09; Packing Type: TAPE_&_REEL; Packing Size: 10000; Budget Currency: EUR; Budget Price: 0.128; Lead Time: 9; NOTE Status: PREFERRED; Frequency: 6GHz; Min Tol: -2%; Max Tol: +2%; PCB Package: 0402; Old Footprint: IND_LQW15AN; ALT_SYMBOLS: IND_LQW15AM,IND_LQW15AL; FPLIST: IND_LQW15AN,IND_LQW15AM,IND_LQW15AL; Value: 6.8nH; MSL: N/A; MTBF Standard: N/A; MTBF: N/A; Esd Level: N/A; Last Time Buy: N/A; AutoDoc File: http://notefied-dynamic-precision.com/DB/Apps/Desktop/Item/Object.aspx?id=86085; Datasheet URL 2: http://psearch.murata.com/inductor/product/LQW15AN6N8G00%23.pdf; Datasheet URL 1: N/A; WEIGHT: 0.0008g; RoHS Status: ROHS_COMPLIANT; Inductance: 6.8nH; Rtd Current: 0.7A; Min Oper Temp: -55DEGC; Max Oper Temp: +125DEGC; Part Type: INDUCTOR\CHIP\0402; Mounting Type: SMD; Revision: R001
L14 = INDUCTOR: INDUCTOR, CHIP, 6.8nH, -2%/+2%, 0.7A, -55DEGC/+125DEGC, 0402, SMD; MPN Status: ACTIVE; MPN: LQW15AN6N8G00D; Manufacturer: MURATA; Part Number: 03-06553; DIST: FLAT; DIELECTRIC: DSMAX; PSpiceTemplate: L^@REFDES %1 %2 ?TOLERANCE|L^@REFDES| @VALUE ?IC/IC=@IC/ ?TOLERANCE|\n.model l^@REFDES IND L=1 DEV=@TOLERANCE%|; Current: LMAX; Packing Type: TAPE_&_REEL; Packing Size: 10000; Definied Quality: INDUSTRIAL; Budget Currency: EUR; Budget Price: 0.128; Lead Time: 9; NOTE Status: PREFERRED; Frequency: 6GHz; Resistance: 0.09; Min Tol: -2%; Max Tol: +2%; PCB Package: 0402; Old Footprint: IND_LQW15AN; ALT_SYMBOLS: IND_LQW15AM,IND_LQW15AL; FPLIST: IND_LQW15AN,IND_LQW15AM,IND_LQW15AL; Value: 6.8nH; AutoDoc File: http://notefied-dynamic-precision.com/DB/Apps/Desktop/Item/Object.aspx?id=86085; Datasheet URL 2: http://psearch.murata.com/inductor/product/LQW15AN6N8G00%23.pdf; Datasheet URL 1: N/A; MSL: N/A; MTBF Standard: N/A; MTBF: N/A; Esd Level: N/A; WEIGHT: 0.0008g; Last Time Buy: N/A; RoHS Status: ROHS_COMPLIANT; Inductance: 6.8nH; Rtd Current: 0.7A; Min Oper Temp: -55DEGC; Max Oper Temp: +125DEGC; Part Type: INDUCTOR\CHIP\0402; Mounting Type: SMD; Revision: R001
L15 = INDUCTOR: INDUCTOR, CHIP, 12nH, -5%/+5%, 0.5A, -55DEGC/+125DEGC, 0402, SMD; MPN Status: ACTIVE; MPN: LQW15AN12NJ00D; Manufacturer: MURATA; Part Number: 03-06556; DIST: FLAT; DIELECTRIC: DSMAX; PSpiceTemplate: L^@REFDES %1 %2 ?TOLERANCE|L^@REFDES| @VALUE ?IC/IC=@IC/ ?TOLERANCE|\n.model l^@REFDES IND L=1 DEV=@TOLERANCE%|; Current: LMAX; Packing Type: TAPE_&_REEL; Packing Size: 10000; Definied Quality: INDUSTRIAL; Budget Currency: EUR; Budget Price: 0.117; Lead Time: 9; NOTE Status: PREFERRED; Frequency: 5.5GHz; Min Tol: -5%; Old Footprint: IND_LQW15AN; ALT_SYMBOLS: IND_LQW15AM,IND_LQW15AL; FPLIST: IND_LQW15AN,IND_LQW15AM,IND_LQW15AL; PCB Package: 0402; Max Tol: +5%; Resistance: 0.14; Value: 12nH; AutoDoc File: http://notefied-dynamic-precision.com/DB/Apps/Desktop/Item/Object.aspx?id=86088; Datasheet URL 2: http://psearch.murata.com/inductor/product/LQW15AN12NJ00%23.pdf; Datasheet URL 1: N/A; MSL: N/A; MTBF Standard: N/A; MTBF: N/A; Esd Level: N/A; WEIGHT: 0.0008g; RoHS Status: ROHS_COMPLIANT; Rtd Current: 0.5A; Min Oper Temp: -55DEGC; Max Oper Temp: +125DEGC; Part Type: INDUCTOR\CHIP\0402; Mounting Type: SMD; Revision: R001; Inductance: 12nH; Last Time Buy: N/A
L21 = INDUCTOR: INDUCTOR, CHIP, 7.5nH, -2%/+2%, 0.57A, -55DEGC/+125DEGC, 0402, SMD; MPN Status: NRND; MPN: LQW15AN7N5G00D; Manufacturer: MURATA; Part Number: 03-06551; DIST: FLAT; DIELECTRIC: DSMAX; PSpiceTemplate: L^@REFDES %1 %2 ?TOLERANCE|L^@REFDES| @VALUE ?IC/IC=@IC/ ?TOLERANCE|\n.model l^@REFDES IND L=1 DEV=@TOLERANCE%|; Current: LMAX; FPLIST: IND_LQW15AN,IND_LQW15AM,IND_LQW15AL; Packing Type: TAPE_&_REEL; Packing Size: 10000; Budget Currency: EUR; Budget Price: 0.128; Lead Time: 9; NOTE Status: PREFERRED; Frequency: 6GHz; Resistance: 0.13; Min Tol: -2%; Max Tol: +2%; PCB Package: 0402; ALT_SYMBOLS: IND_LQW15AM,IND_LQW15AL; Definied Quality: INDUSTRIAL; Value: 7.5nH; AutoDoc File: http://notefied-dynamic-precision.com/DB/Apps/Desktop/Item/Object.aspx?id=86081; Datasheet URL 2: http://psearch.murata.com/inductor/product/LQW15AN7N5G00%23.pdf; Datasheet URL 1: N/A; WEIGHT: 0.0008g; RoHS Status: ROHS_COMPLIANT; Inductance: 7.5nH; Rtd Current: 0.57A; Min Oper Temp: -55DEGC; Max Oper Temp: +125DEGC; Part Type: INDUCTOR\CHIP\0402; Mounting Type: SMD; Old Footprint: IND_LQW15AN; Revision: R001; Last Time Buy: N/A; Esd Level: N/A; MTBF: N/A; MTBF Standard: N/A; MSL: N/A
L331 = INDUCTOR: INDUCTOR, CHIP, FERRITE CORE, 6.8uH, -20%/+20%, IR:1.1A, -55DEGC/+125DEGC, 0805, SMD; Part Number: 03-07266; Manufacturer: TDK; MPN: MLZ2012N6R8LT000; MPN Status: ACTIVE; DIST: FLAT; DIELECTRIC: DSMAX; PSpiceTemplate: L^@REFDES %1 %2 ?TOLERANCE|L^@REFDES| @VALUE ?IC/IC=@IC/ ?TOLERANCE|\n.model l^@REFDES IND L=1 DEV=@TOLERANCE%|; Current: LMAX; Resistance: 0.25; FPLIST: INDC2012X150N,INDC2012X150L,INDC2012X150M; ALT_SYMBOLS: INDC2012X150L,INDC2012X150M; Old Footprint: INDC2012X150N; PCB Package: 0805; Max Tol: +20%; Min Tol: -20%; Rtd Current: 1.1A; NOTE Status: PREFERRED; Packing Size: 4000; Packing Type: TAPE_&_REEL; Value: 6.8uH; WEIGHT: 0.01g; Revision: R001; Mounting Type: SMD; Part Type: INDUCTOR\CHIP\0805; Max Oper Temp: +125DEGC; Min Oper Temp: -55DEGC; Inductance: 6.8uH; RoHS Status: ROHS_COMPLIANT; Datasheet URL 1: N/A; Datasheet URL 2: http://product.tdk.com/inductor/ind/detailed_information.php?lang=en&ref=us&part_no=MLZ2012N6R8LT000; AutoDoc File: http://notefied-dynamic-precision.com/DB/Apps/Desktop/Item/Object.aspx?id=102853
P1 P2 = CONN_HEADER_2X10_P_S: CONNECTOR, HEADER, FEMALE, STRAIGHT, 2 ROWS, 20 PINS, PITCH 1.27mm, SMD; MPN Status: ACTIVE; MPN: SFM-110-02-SM-D-A-K-TR; Manufacturer: SAMTEC; Part Number: 06-02251; Packing Type: TAPE_&_REEL; Packing Size: 125; NOTE Status: PREFERRED; No Of Rows: 2; No Of Pos: 20; Min Oper Temp: -55DEGC; Max Oper Temp: +125DEGC; Alt IPC Footprints: SAMTEC_SFM11002AL,SAMTEC_SFM11002AM; AutoDoc File: https://notefied-dynamic-precision.com/NotefiedWebServices/AutoDocs.aspx?itemid=85603; Datasheet URL 2: http://www.samtec.com/documents/webfiles/cpdf/SFM-1XX-XX-XX-S-XX-MKT1.pdf; Datasheet URL 1: http://www.samtec.com/ProductInformation/TechnicalSpecifications/CatalogPages.aspx?series=SFM; RoHS Status: ROHS_COMPLIANT; Pitch: 1.27mm; Part Type: CONNECTOR\HEADER; Mounting Type: SMD; Old Footprint: SAMTEC_SFM11002AN; Revision: R001
R11 = RESISTOR: RESISTOR, THICK FILM, 0, -5%/+5%, 0.063W, 50V, -55DEGC/+155DEGC, 0402, SMD; MPN Status: ACTIVE; MPN: RESISTOR_0402_0_+/-5%_50V_0.063W_M_+/-200PPM; Manufacturer: MANUFACTURER SELECTION; Part Number: 01-11587; PSpiceTemplate: R^@REFDES %1 %2 ?TOLERANCE|R^@REFDES| @VALUE TC=@TC1,@TC2 ?TOLERANCE|\n.model R^@REFDES RES R=1 DEV=@TOLERANCE%|; VOLTAGE: RVMAX; DIST: FLAT; MAX_TEMP: RTMAX; POWER: RMAX; Packing Type: TAPE_&_REEL; Packing Size: 10000; Definied Quality: INDUSTRIAL; Budget Currency: USD; Budget Price: 0.00244; NOTE Status: PREFERRED; Min TC: -200PPM/DEGC; Max TC: +200PPM/DEGC; Min Tol: -5%; Max Tol: +5%; PCB Package: 0402; Old Footprint: RESC1005X40N; ALT_SYMBOLS: RESC1005X40L,RESC1005X40M; FPLIST: RESC1005X40N,RESC1005X40L,RESC1005X40M; TC1: 0; TC2: 0; Value: 0; AutoDoc File: http://notefied-dynamic-precision.com/DB/Apps/Desktop/Item/Object.aspx?id=75642; Datasheet URL 2: N/A; Datasheet URL 1: N/A; MSL: N/A; MTBF Standard: N/A; MTBF: N/A; Esd Level: N/A; WEIGHT: N/A; Last Time Buy: N/A; Lead Time: N/A; LifeCycle Status: ACTIVE; RoHS Status: ROHS_COMPLIANT; Resistor Type: THICK FILM; Resistance: 0; Rtd Power: 0.063W; Rtd Voltage: 50V; Min Oper Temp: -55DEGC; Max Oper Temp: +155DEGC; Part Type: RESISTOR\0402; Mounting Type: SMD; Revision: R001
R12 = RESISTOR: RESISTOR, DO NOT MOUNT, 0402, SMD; MPN Status: ACTIVE; Part Number: 01-02472; PSpiceTemplate: R^@REFDES %1 %2 ?TOLERANCE|R^@REFDES| @VALUE TC=@TC1,@TC2 ?TOLERANCE|\n.model R^@REFDES RES R=1 DEV=@TOLERANCE%|; VOLTAGE: RVMAX; DIST: FLAT; MAX_TEMP: RTMAX; TC1: 0; POWER: RMAX; NOTE Status: PREFERRED; PCB Package: 0402; Old Footprint: RESC1005X40N,0402; ALT_SYMBOLS: RESC1005X40L,RESC1005X40M; FPLIST: RESC1005X40N,RESC1005X40L,RESC1005X40M; TC2: 0; Value: DNM; AutoDoc File: http://notefied-dynamic-precision.com/DB/Apps/Desktop/Item/Object.aspx?id=48356; Datasheet URL 2: N/A; Datasheet URL 1: N/A; MSL: N/A; MTBF Standard: N/A; MTBF: N/A; Esd Level: N/A; WEIGHT: N/A; Packing Size: N/A; Last Time Buy: N/A; Budget Currency: N/A; Budget Price: N/A; Lead Time: N/A; RoHS Status: PART NOT KNOWN; MPN: DNM; Manufacturer: DO NOT MOUNT; Min Oper Temp: N/A; Max Oper Temp: N/A; Part Type: RESISTOR\0402; Mounting Type: SMD; Revision: R002
R351 = RESISTOR: RESISTOR, THICK FILM, 100k, -1%/+1%, 0.063W, 50V, -55DEGC/+155DEGC, 0402, SMD; MPN Status: ACTIVE; MPN: RESISTOR_0402_100k_+/-1%_50V_0.063W_M_+/-100PPM; Manufacturer: MANUFACTURER SELECTION; Part Number: 01-12837; PSpiceTemplate: R^@REFDES %1 %2 ?TOLERANCE|R^@REFDES| @VALUE TC=@TC1,@TC2 ?TOLERANCE|\n.model R^@REFDES RES R=1 DEV=@TOLERANCE%|; VOLTAGE: RVMAX; DIST: FLAT; MAX_TEMP: RTMAX; TC1: 0; POWER: RMAX; Packing Type: TAPE_&_REEL; Packing Size: 10000; Definied Quality: INDUSTRIAL; Budget Currency: USD; Budget Price: 0.00244; NOTE Status: PREFERRED; Min TC: -100PPM/DEGC; Max TC: +100PPM/DEGC; Min Tol: -1%; Max Tol: +1%; PCB Package: 0402; Old Footprint: RESC1005X40N; ALT_SYMBOLS: RESC1005X40L,RESC1005X40M; FPLIST: RESC1005X40N,RESC1005X40L,RESC1005X40M; TC2: 0; Value: 100k; AutoDoc File: http://notefied-dynamic-precision.com/DB/Apps/Desktop/Item/Object.aspx?id=76892; Datasheet URL 2: N/A; Datasheet URL 1: N/A; MSL: N/A; MTBF Standard: N/A; MTBF: N/A; Esd Level: N/A; WEIGHT: N/A; Last Time Buy: N/A; Lead Time: N/A; LifeCycle Status: ACTIVE; RoHS Status: ROHS_COMPLIANT; Resistor Type: THICK FILM; Resistance: 100k; Rtd Power: 0.063W; Rtd Voltage: 50V; Min Oper Temp: -55DEGC; Max Oper Temp: +155DEGC; Part Type: RESISTOR\0402\PRECISION; Mounting Type: SMD; Revision: R002
U1 = IC_RF_CC13XX_7X7_QFN48_V2: IC, DIGITAL, CUSTOM, CC13xx 7x7, QFN48, SMD; MPN Status: ACTIVE; Manufacturer: TEXAS INSTRUMENTS; Part Number: 18-28964; SWAP_INFO: (S1+S2); SPLIT_INST: TRUE; Designed_By: Artur Bielinski; Definied Quality: COMMERCIAL; NOTE Status: PREFERRED; ALT_SYMBOLS: QFNFC50P700X700X80-49CL,QFNFC50P700X700X80-49CM; FPLIST: QFNFC50P700X700X80-49CN,QFNFC50P700X700X80-49CL,QFNFC50P700X700X80-49CM; Design_Date: 2014-09-04; AutoDoc File: http://notefied-dynamic-precision.com/DB/Apps/Desktop/Item/Object.aspx?id=90625; Datasheet URL 2: www.ti.com; Datasheet URL 1: N/A; MSL: N/A; MTBF Standard: N/A; MTBF: N/A; Esd Level: N/A; WEIGHT: N/A; Packing Type: N/A; Packing Size: N/A; Last Time Buy: N/A; Budget Currency: N/A; Budget Price: N/A; Lead Time: N/A; RoHS Status: PART NOT KNOWN; MPN: CC13xx 7x7; Rtd Voltage: N/A; Min Oper Temp: N/A; Max Oper Temp: N/A; Part Type: IC\DIGITAL\OTHER; Mounting Type: SMD; PCB Package: QFN48; Old Footprint: QFNFC50P700X700X80-49CN; Revision: R003
Y1 = CRYSTAL: CRYSTAL, RESONATOR, 32.768kHz, -20PPM/+20PPM, -40DEGC/+85DEGC, SMD; MPN Status: ACTIVE; MPN: FC-135 32.7680KA-AG0; Manufacturer: EPSON; Part Number: 12-00546; Packing Type: TAPE_&_REEL; Packing Size: 1000; Definied Quality: INDUSTRIAL; Budget Currency: USD; Budget Price: 1.25375; Lead Time: 10; NOTE Status: PREFERRED; Capacitance: 7pF; Min Tol: -20PPM; Max Tol: +20PPM; ALT_SYMBOLS: XTAL_FC-135L,XTAL_FC-135M; FPLIST: XTAL_FC-135N,XTAL_FC-135L,XTAL_FC-135M; AutoDoc File: http://notefied-dynamic-precision.com/DB/Apps/Desktop/Item/Object.aspx?id=91966; Datasheet URL 2: http://www.eea.epson.com/portal/pls/portal/docs/1/1525451.PDF; Datasheet URL 1: http://www.eea.epson.com/portal/pls/portal/docs/1/1525528.PDF; MSL: N/A; MTBF Standard: N/A; MTBF: N/A; Esd Level: N/A; WEIGHT: N/A; Last Time Buy: N/A; RoHS Status: ROHS_COMPLIANT; Frequency: 32.768kHz; Min Oper Temp: -40DEGC; Max Oper Temp: +85DEGC; Part Type: CRYSTAL\OSCILLATOR\MEMS; Mounting Type: SMD; Old Footprint: XTAL_FC-135N; Revision: R001
Y2 = XTAL_4PIN_S: CRYSTAL, CRYSTAL OSCILLATOR, 24MHz, -15PPM/DEGC/+15PPM/DEGC, -40DEGC/+85DEGC, SMD; Part Number: 12-00757; Manufacturer: EPSON; MPN: TSX-3225 24.0000MF15X-AC3; MPN Status: ACTIVE; FPLIST: OSCCC250X320X60-4N,OSCCC250X320X60-4L,OSCCC250X320X60-4M; ALT_SYMBOLS: OSCCC250X320X60-4L,OSCCC250X320X60-4M; Old Footprint: OSCCC250X320X60-4N; Max Tol: +10PPM; Min Tol: -10PPM; Capacitance: 9pF; NOTE Status: PREFERRED; Lead Time: 12; Budget Price: 0.256; Budget Currency: EUR; Packing Size: 250; Packing Type: TAPE_&_REEL; Revision: R001; Mounting Type: SMD; Part Type: CRYSTAL\OSCILLATOR; Max Oper Temp: +85DEGC; Min Oper Temp: -40DEGC; Max TC: +15PPM/DEGC; Min TC: -15PPM/DEGC; Frequency: 24MHz; RoHS Status: ROHS_COMPLIANT; Datasheet URL 1: http://www.eea.epson.com/portal/pls/portal/docs/1/1721495.PDF; Datasheet URL 2: http://www.epsondevice.com/docs/qd/en/DownloadServlet?id=ID000658; AutoDoc File: http://notefied-dynamic-precision.com/DB/Apps/Desktop/Item/Object.aspx?id=96738